# Altium schematic sheet 9-Protections 1 of 2.SchDoc
size A
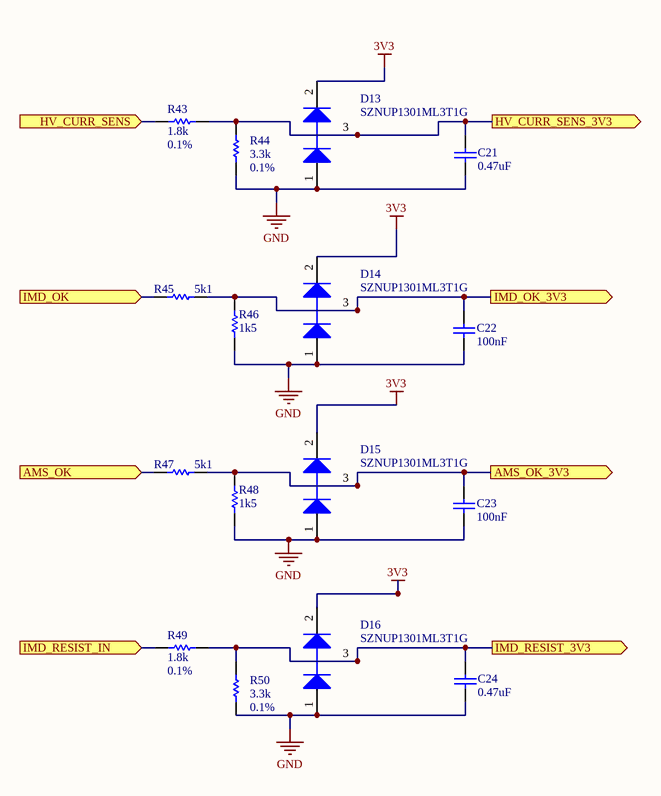
[diagram p0: 9-Protections 1 of 2.SchDoc]

## Parts
C21  value 0.47uF  [1608[0603]]  (hidden comment: Cap)
C22  value 100nF  [1608[0603]]  (hidden comment: Cap)
C23  value 100nF  [1608[0603]]  (hidden comment: Cap)
C24  value 0.47uF  [1608[0603]]  (hidden comment: Cap)
D13  SZNUP1301ML3T1G  [ONSC-SOT-23-3-318-08_V]
D14  SZNUP1301ML3T1G  [ONSC-SOT-23-3-318-08_V]
D15  SZNUP1301ML3T1G  [ONSC-SOT-23-3-318-08_V]
D16  SZNUP1301ML3T1G  [ONSC-SOT-23-3-318-08_V]
R43  value 1.8k  Tolerance: 0.1%  [1608[0603]]  (hidden comment: Res1)
R44  value 3.3k  Tolerance: 0.1%  [1608[0603]]  (hidden comment: Res1)
R45  value 5k1  [1608[0603]]  (hidden comment: Res1)
R46  value 1k5  [1608[0603]]  (hidden comment: Res1)
R47  value 5k1  [1608[0603]]  (hidden comment: Res1)
R48  value 1k5  [1608[0603]]  (hidden comment: Res1)
R49  value 1.8k  Tolerance: 0.1%  [1608[0603]]  (hidden comment: Res1)
R50  value 3.3k  Tolerance: 0.1%  [1608[0603]]  (hidden comment: Res1)

## Ports
AMS_OK (in), AMS_OK_3V3 (out), HV_CURR_SENS (in), HV_CURR_SENS_3V3 (out), IMD_OK (in), IMD_OK_3V3 (out), IMD_RESIST_3V3 (out), IMD_RESIST_IN (in)

## Nets
3V3: D13.2(K) D14.2(K) D15.2(K) D16.2(K)
GND: C21.1 C22.1 C23.1 C24.1 D13.1(A) D14.1(A) D15.1(A) D16.1(A) R44.1 R46.1 R48.1 R50.1
AMS_OK: R47.1 ; port AMS_OK
AMS_OK_3V3: C23.2 D15.3(K/A) R47.2 R48.2 ; port AMS_OK_3V3
HV_CURR_SENS: R43.2 ; port HV_CURR_SENS
HV_CURR_SENS_3V3: C21.2 D13.3(K/A) R43.1 R44.2 ; port HV_CURR_SENS_3V3
IMD_OK: R45.1 ; port IMD_OK
IMD_OK_3V3: C22.2 D14.3(K/A) R45.2 R46.2 ; port IMD_OK_3V3
IMD_RESIST_3V3: C24.2 D16.3(K/A) R49.1 R50.2 ; port IMD_RESIST_3V3
IMD_RESIST_IN: R49.2 ; port IMD_RESIST_IN

## Library data of the parts
C21 C24 = Cap: Capacitor; Manufacturer: Yageo; Manufacturer Part Number: CC0603KRX7R8BB474; Capacitance: 0.47µF; Tolerance: ±10%; Voltage - Rated: 25V; Temperature Coefficient: X7R; Supplier 1: Digi-Key; Supplier Part Number 1: 311-1805-1-ND; RoHS: RoHS Compliant; Category: Capacitors; Stock 1: 11076; Pricing 1: 1=0.22, 10=0.158, 25=0.1156, 50=0.0898, 100=0.0745, 250=0.06168, 500=0.05226, 1000=0.04324 (CAD); Packaging: Cut Tape (CT); Part Status: Active; Operating Temperature: -55°C ~ 125°C; Features: -; Ratings: -; Applications: General Purpose; Failure Rate: -; Mounting Type: Surface Mount, MLCC; Package / Case: 0603 (1608 Metric); Size / Dimension: 0.063" L x 0.031" W (1.60mm x 0.80mm); Height - Seated (Max): -; Thickness (Max): 0.035" (0.90mm); Lead Spacing: -; Lead Style: -; ComponentLink1URL: http://www.yageo.com/documents/recent/UPY-GPHC_X7R_6.3V-to-50V_16.pdf; ComponentLink1Description: http://www.yageo.com/documents/recent/UPY-GPHC_X7R_6.3V-to-50V_16.pdf
C22 C23 = Cap: Capacitor; Manufacturer: Yageo; Manufacturer Part Number: CC0603KRX7R9BB104; Capacitance: 0.10µF; Tolerance: ±10%; Voltage - Rated: 50V; Temperature Coefficient: X7R; Supplier 1: Digi-Key; Supplier Part Number 1: 311-1344-1-ND; RoHS: RoHS Compliant; Category: Capacitors; Stock 1: 4016262; Pricing 1: 1=0.15, 10=0.043, 25=0.0312, 50=0.0232, 100=0.0189, 250=0.0158, 500=0.01346, 1000=0.01059 (CAD); Packaging: Cut Tape (CT); Part Status: Active; Operating Temperature: -55°C ~ 125°C; Features: -; Ratings: -; Applications: General Purpose; Failure Rate: -; Mounting Type: Surface Mount, MLCC; Package / Case: 0603 (1608 Metric); Size / Dimension: 0.063" L x 0.031" W (1.60mm x 0.80mm); Height - Seated (Max): -; Thickness (Max): 0.035" (0.90mm); Lead Spacing: -; Lead Style: -; ComponentLink1URL: http://www.yageo.com/documents/recent/UPY-GPHC_X7R_6.3V-to-50V_16.pdf; ComponentLink1Description: http://www.yageo.com/documents/recent/UPY-GPHC_X7R_6.3V-to-50V_16.pdf
D13-D16 = CMP-1063-00171-1: Low Capacitance Diode Array for ESD Protection in a Single Data Line, 3-Pin SOT-23, Pb-Free, Tape and Reel; Manufacturer: On Semiconductor; C Max (pF): 0.9; Direction: Bidirectional; V(BR) Min (V): 70; Number of Lines: 1; Mounting Technology: Surface Mount; PackageReference: SOT-23-3-318-08; DatasheetVersion: Rev. 6; PackageVersion: Rev. AP, 11/2009; RoHS: Pb-Free; ComponentLink1Description: Manufacturer URL; ComponentLink1URL: http://www.onsemi.com/; PackageDescription: 3-Pin Small Outline Transistor, Body 2.92 x 1.3 mm, Pitch 0.95 mm; PartNumber: SZNUP1301ML3T1G; Packing: Tape and Reel; ComponentLink3URL: http://www.onsemi.cn/pub_link/Collateral/318-08.PDF; ComponentLink3Description: Package Specification; VRWM Max (V): 70; ComponentLink2Description: Datasheet; ComponentLink2URL: http://www.onsemi.cn/pub_link/Collateral/NUP1301ML3T1-D.PDF
R43 R49 = Res1: Resistor; Manufacturer: Panasonic Electronic Components; Manufacturer Part Number: ERJ-PB6B1801V; Power (Watts): 0.25W, 1/4W; Temperature Coefficient: ±50ppm/°C; RoHS: RoHS Compliant; Category: Resistors; Stock 1: 4965; Pricing 1: 1=0.54, 10=0.461, 25=0.3348, 50=0.243, 100=0.1801, 250=0.13812, 500=0.10886, 1000=0.07537 (CAD); Packaging: Cut Tape (CT); Part Status: Active; Resistance (Ohms): 1.8k; Composition: Thick Film; Features: Automotive AEC-Q200, Pulse Withstanding; Operating Temperature: -55°C ~ 155°C; Package / Case: 0805 (2012 Metric); Supplier Device Package: 0805; Size / Dimension: 0.079" L x 0.049" W (2.00mm x 1.25mm); Height - Seated (Max): 0.028" (0.70mm); Failure Rate: -; ComponentLink1URL: https://industrial.panasonic.com/cdbs/www-data/pdf/RDM0000/AOA0000C100.pdf; ComponentLink1Description: https://industrial.panasonic.com/cdbs/www-data/pdf/RDM0000/AOA0000C100.pdf; Supplier 1: Digi-Key; Supplier Part Number 1: P20621CT-ND
R44 R50 = Res1: Resistor; Manufacturer: Panasonic Electronic Components; Manufacturer Part Number: ERJ-PB6B3301V; Power (Watts): 0.25W, 1/4W; Temperature Coefficient: ±50ppm/°C; RoHS: RoHS Compliant; Category: Resistors; Stock 1: 4675; Pricing 1: 1=0.54, 10=0.461, 25=0.3348, 50=0.243, 100=0.1801, 250=0.13812, 500=0.10886, 1000=0.07537 (CAD); Packaging: Cut Tape (CT); Part Status: Active; Resistance (Ohms): 3.3k; Composition: Thick Film; Features: Automotive AEC-Q200, Pulse Withstanding; Operating Temperature: -55°C ~ 155°C; Package / Case: 0805 (2012 Metric); Supplier Device Package: 0805; Size / Dimension: 0.079" L x 0.049" W (2.00mm x 1.25mm); Height - Seated (Max): 0.028" (0.70mm); Failure Rate: -; ComponentLink1URL: https://industrial.panasonic.com/cdbs/www-data/pdf/RDM0000/AOA0000C100.pdf; ComponentLink1Description: https://industrial.panasonic.com/cdbs/www-data/pdf/RDM0000/AOA0000C100.pdf; Supplier 1: Digi-Key; Supplier Part Number 1: P20651CT-ND
R45-R48 = Res1: Resistor; Manufacturer: Yageo; Manufacturer Part Number: RC0603JR-075K1L; Resistance (Ohms): 5.1k; Tolerance: ±5%; Power (Watts): 0.1W, 1/10W; Temperature Coefficient: ±100ppm/°C; Supplier 1: Digi-Key; RoHS: RoHS Compliant; Category: Resistors; Packaging: Cut Tape (CT); Part Status: Active; Composition: Thick Film; Features: Moisture Resistant; Operating Temperature: -55°C ~ 155°C; Package / Case: 0603 (1608 Metric); Supplier Device Package: 0603; Size / Dimension: 0.063" L x 0.031" W (1.60mm x 0.80mm); Height - Seated (Max): 0.022" (0.55mm); Number of Terminations: 2; Failure Rate: -; ComponentLink1URL: http://www.yageo.com/NewPortal/yageodocoutput?fileName=/pdf/R-Chip/PYu-RC_Group_51_RoHS_L_4.pdf; ComponentLink1Description: http://www.yageo.com/NewPortal/yageodocoutput?fileName=/pdf/R-Chip/PYu-RC_Group_51_RoHS_L_4.pdf
  R45 R47: Supplier Part Number 1: 311-5.1KGRCT-ND; Stock 1: 782184; Pricing 1: 1=0.16, 10=0.016, 25=0.0112, 50=0.0084, 100=0.0062, 250=0.0048, 500=0.00382, 1000=0.00281 (CAD)
  R46 R48: Supplier Part Number 1: 541-2789-1-ND; Stock 1: 14165; Pricing 1: 1=0.21, 10=0.192, 25=0.1332, 50=0.1038, 100=0.0741, 250=0.05776, 500=0.04586, 1000=0.03257 (CAD); ComponentLink2URL: http://www.vishay.com/docs/20065/rcse3.pdf; ComponentLink2Description: http://www.vishay.com/docs/20065/rcse3.pdf